# EAGLE schematic Module_AIO (EAGLE 9.2.1)

## Sheet 1 of 5: ANALOG INPUT
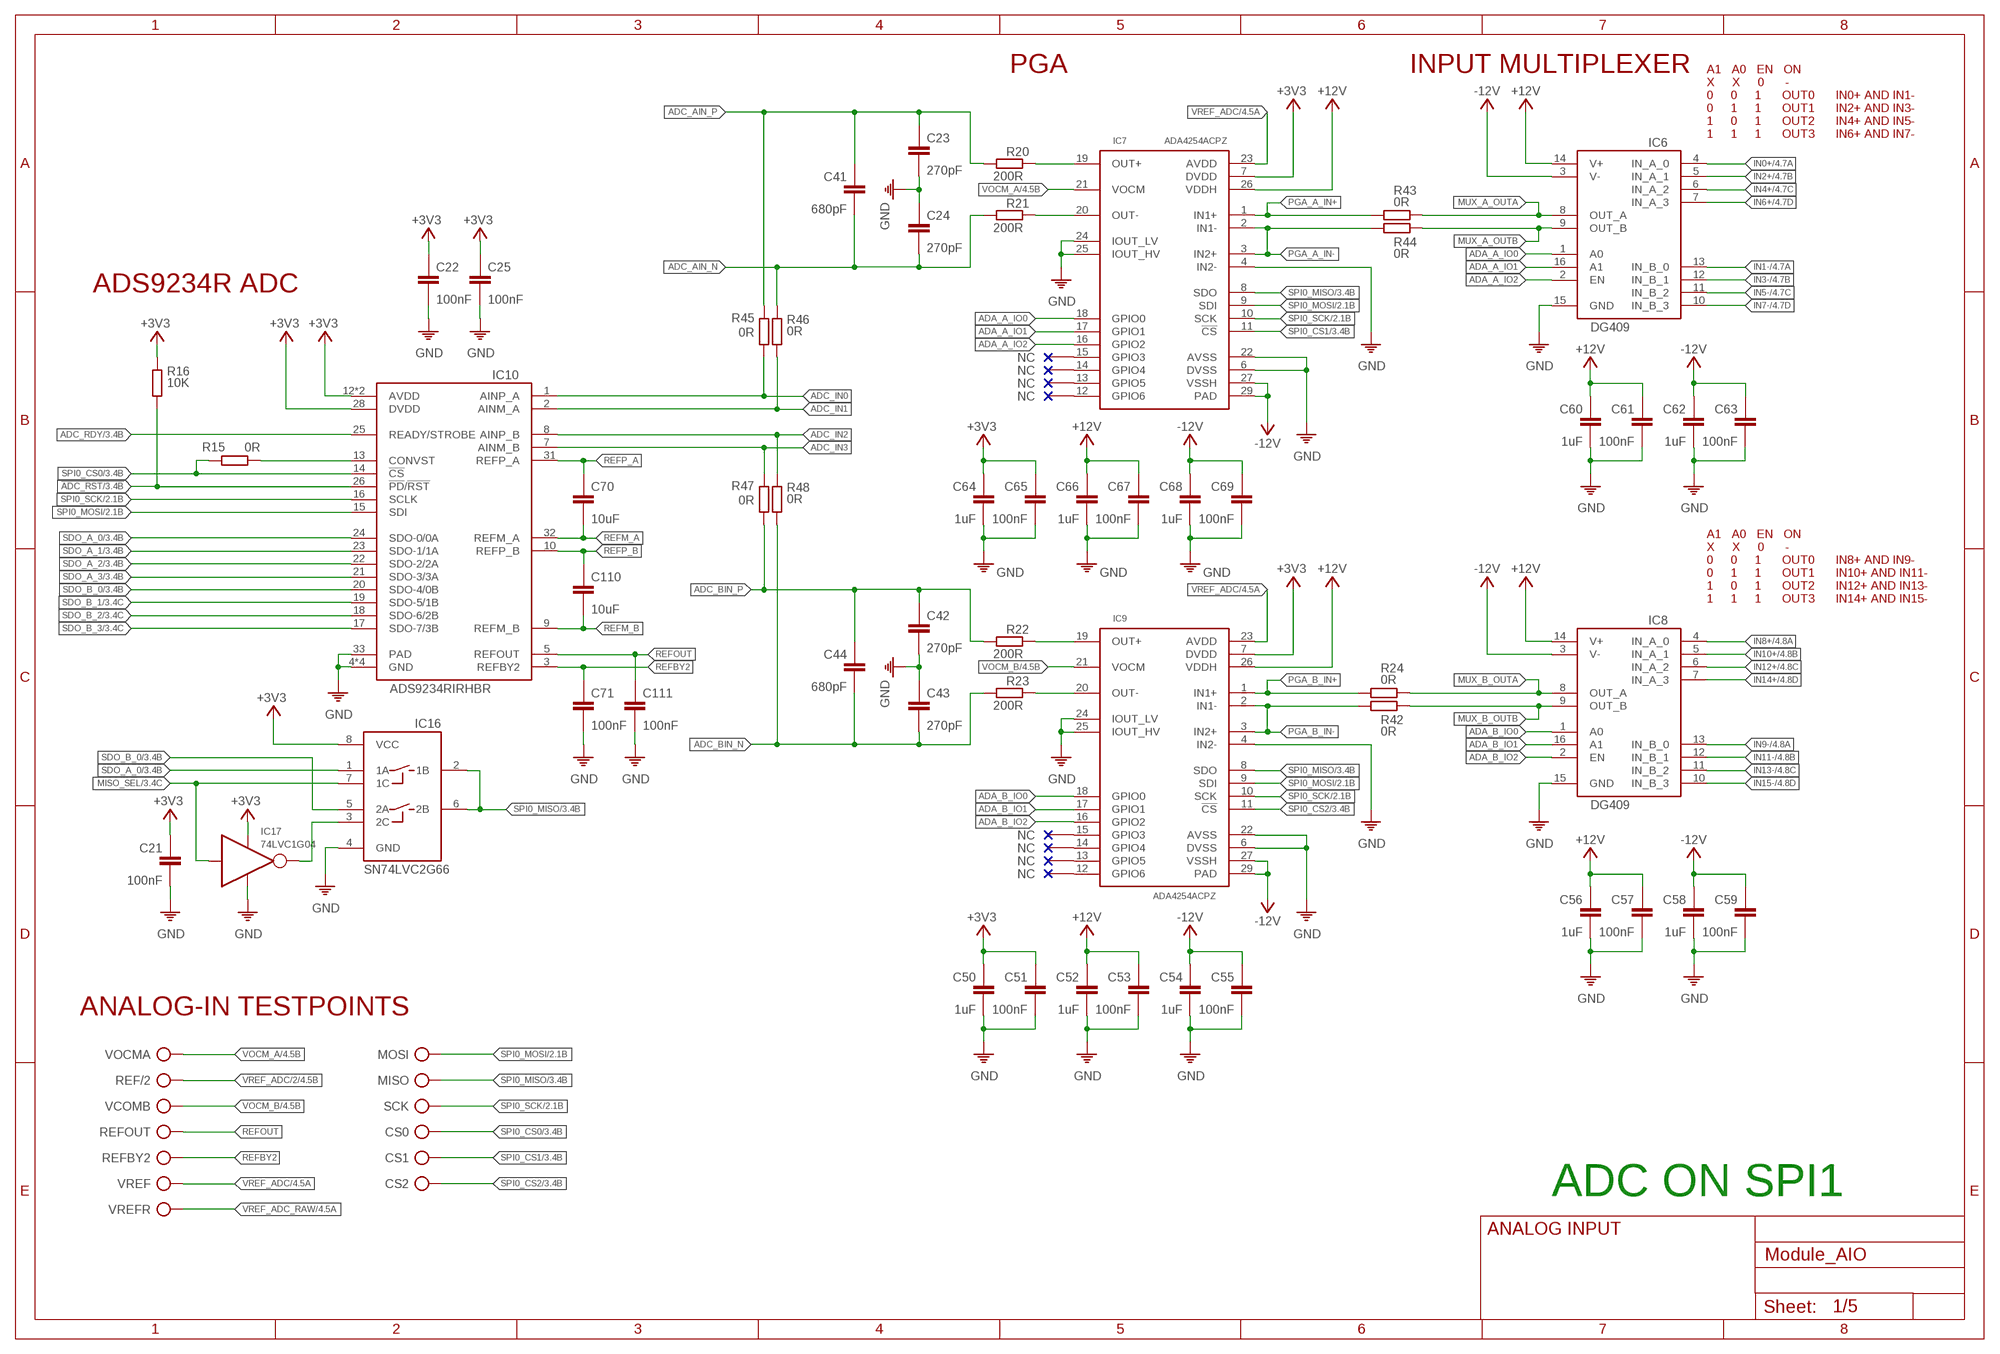
[diagram p0: schematic, sheet 1]

### Parts
C21  100nF  C-0402  [C0402]
C22  100nF  C-0402  [C0402]
C23  270pF  C-0402  [C0402]
C24  270pF  C-0402  [C0402]
C25  100nF  C-0402  [C0402]
C41  680pF  C-0402  [C0402]
C42  270pF  C-0402  [C0402]
C43  270pF  C-0402  [C0402]
C44  680pF  C-0402  [C0402]
C50  1uF  C-0402  [C0402]
C51  100nF  C-0402  [C0402]
C52  1uF  C-0402  [C0402]
C53  100nF  C-0402  [C0402]
C54  1uF  C-0402  [C0402]
C55  100nF  C-0402  [C0402]
C56  1uF  C-0402  [C0402]
C57  100nF  C-0402  [C0402]
C58  1uF  C-0402  [C0402]
C59  100nF  C-0402  [C0402]
C60  1uF  C-0402  [C0402]
C61  100nF  C-0402  [C0402]
C62  1uF  C-0402  [C0402]
C63  100nF  C-0402  [C0402]
C64  1uF  C-0402  [C0402]
C65  100nF  C-0402  [C0402]
C66  1uF  C-0402  [C0402]
C67  100nF  C-0402  [C0402]
C68  1uF  C-0402  [C0402]
C69  100nF  C-0402  [C0402]
C70  10uF  C-0402  [C0402]
C71  100nF  C-0402  [C0402]
C110  10uF  C-0402  [C0402]
C111  100nF  C-0402  [C0402]
CS0  TP  [TP]
CS1  TP  [TP]
CS2  TP  [TP]
IC6  DG409  DG409EUE+  [TSSOP2]
IC7  ADA4254ACPZ  [QFN50P500X500X75-29T314N]
IC8  DG409  DG409EUE+  [TSSOP2]
IC9  ADA4254ACPZ  [QFN50P500X500X75-29T314N]
IC10  ADS9234RIRHBR  [VQFN32-5X5]
IC16  SN74LVC2G66  [SOP50P310X90-8N]
IC17  74LVC1G04  [SOT95P280X145-5N]
MISO  TP  [TP]
MOSI  TP  [TP]
R15  0R  R0402  [0402]
R16  10K  R0402  [0402]
R20  200R  R0402  [0402]
R21  200R  R0402  [0402]
R22  200R  R0402  [0402]
R23  200R  R0402  [0402]
R24  0R  R0402  [0402]
R42  0R  R0402  [0402]
R43  0R  R0402  [0402]
R44  0R  R0402  [0402]
R45  0R  R0402  [0402]
R46  0R  R0402  [0402]
R47  0R  R0402  [0402]
R48  0R  R0402  [0402]
REF/2  TP  [TP]
REFBY2  TP  [TP]
REFOUT  TP  [TP]
SCK  TP  [TP]
VCOMB  TP  [TP]
VOCMA  TP  [TP]
VREF  TP  [TP]
VREFR  TP  [TP]

### Nets
!ADC_RST: IC10.26(!PD!/!RST) R16.2 ; also sheet 3,4
!MISO_SEL: IC16.3(2C) IC17.4(OUT)
+3V3: C21.1 C22.1 C25.1 C50.1 C51.1 C64.1 C65.1 IC7.7(DVDD) IC9.7(DVDD) IC10.12(AVDD) IC10.28(DVDD) IC10.29(AVDD) IC16.8(VCC) IC17.5(V+) R16.1 ; also sheet 2,3,4
+12V: C52.1 C53.1 C56.1 C57.1 C60.1 C61.1 C66.1 C67.1 IC6.14(V+) IC7.26(VDDH) IC8.14(V+) IC9.26(VDDH) ; also sheet 2,5
-12V: C54.1 C55.1 C58.1 C59.1 C62.1 C63.1 C68.1 C69.1 IC6.3(V-) IC7.27(VSSH) IC7.29(PAD) IC8.3(V-) IC9.27(VSSH) IC9.29(PAD) ; also sheet 2,5
ADA_A_IO0: IC6.1(A0) IC7.18(GPIO0)
ADA_A_IO1: IC6.16(A1) IC7.17(GPIO1)
ADA_A_IO2: IC6.2(EN) IC7.16(GPIO2)
ADA_B_IO0: IC8.1(A0) IC9.18(GPIO0)
ADA_B_IO1: IC8.16(A1) IC9.17(GPIO1)
ADA_B_IO2: IC8.2(EN) IC9.16(GPIO2)
ADC_AIN_N [100R_DIFFPAIR]: C24.2 C41.2 R21.1 R46.1
ADC_AIN_P [100R_DIFFPAIR]: C23.1 C41.1 R20.1 R45.2
ADC_BIN_N [100R_DIFFPAIR]: C43.2 C44.2 R23.1 R48.2
ADC_BIN_P [100R_DIFFPAIR]: C42.1 C44.1 R22.1 R47.1
ADC_IN0: IC10.1(AINP_A) R45.1
ADC_IN1: IC10.2(AINM_A) R46.2
ADC_IN2: IC10.8(AINP_B) R48.1
ADC_IN3: IC10.7(AINM_B) R47.2
ADC_RDY: IC10.25(READY/STROBE) ; also sheet 3,4
GND: C21.2 C22.2 C23.2 C24.1 C25.2 C42.2 C43.1 C50.2 C51.2 C52.2 C53.2 C54.2 C55.2 C56.2 C57.2 C58.2 C59.2 C60.2 C61.2 C62.2 C63.2 C64.2 C65.2 C66.2 C67.2 C68.2 C69.2 C71.2 C111.2 IC6.15(GND) IC7.4(IN2-) IC7.6(DVSS) IC7.22(AVSS) IC7.24(IOUT_LV) IC7.25(IOUT_HV) IC8.15(GND) IC9.4(IN2-) IC9.6(DVSS) IC9.22(AVSS) IC9.24(IOUT_LV) IC9.25(IOUT_HV) IC10.4(GND) IC10.11(GND) IC10.27(GND) IC10.30(GND) IC10.33(PAD) IC16.4(GND) IC17.3(V-) ; also sheet 2,3,4,5
IN0+: IC6.4(IN_A_0) ; also sheet 4
IN1-: IC6.13(IN_B_0) ; also sheet 4
IN2+: IC6.5(IN_A_1) ; also sheet 4
IN3-: IC6.12(IN_B_1) ; also sheet 4
IN4+: IC6.6(IN_A_2) ; also sheet 4
IN5-: IC6.11(IN_B_2) ; also sheet 4
IN6+: IC6.7(IN_A_3) ; also sheet 4
IN7-: IC6.10(IN_B_3) ; also sheet 4
IN8+: IC8.4(IN_A_0) ; also sheet 4
IN9-: IC8.13(IN_B_0) ; also sheet 4
IN10+: IC8.5(IN_A_1) ; also sheet 4
IN11-: IC8.12(IN_B_1) ; also sheet 4
IN12+: IC8.6(IN_A_2) ; also sheet 4
IN13-: IC8.11(IN_B_2) ; also sheet 4
IN14+: IC8.7(IN_A_3) ; also sheet 4
IN15-: IC8.10(IN_B_3) ; also sheet 4
MISO_SEL: IC16.7(1C) IC17.2(IN) ; also sheet 3,4
MUX_A_OUTA: IC6.8(OUT_A) R43.2
MUX_A_OUTB: IC6.9(OUT_B) R44.1
MUX_B_OUTA: IC8.8(OUT_A) R24.2
MUX_B_OUTB: IC8.9(OUT_B) R42.1
N$12: IC7.19(OUT+) R20.2
N$13: IC7.20(OUT-) R21.2
N$15: IC9.19(OUT+) R22.2
N$16: IC9.20(OUT-) R23.2
N$18: IC10.13(CONVST) R15.2
PGA_A_IN+: IC7.1(IN1+) R43.1
PGA_A_IN-: IC7.2(IN1-) IC7.3(IN2+) R44.2
PGA_B_IN+: IC9.1(IN1+) R24.1
PGA_B_IN-: IC9.2(IN1-) IC9.3(IN2+) R42.2
REFBY2: C71.1 IC10.3(REFBY2) REFBY2.TP
REFM_A: C70.2 IC10.32(REFM_A)
REFM_B: C110.2 IC10.9(REFM_B)
REFOUT: C111.1 IC10.5(REFOUT) REFOUT.TP
REFP_A: C70.1 IC10.31(REFP_A)
REFP_B: C110.1 IC10.10(REFP_B)
SDO_A_0: IC10.24(SDO-0/0A) IC16.1(1A) ; also sheet 3,4
SDO_A_1: IC10.23(SDO-1/1A) ; also sheet 3,4
SDO_A_2: IC10.22(SDO-2/2A) ; also sheet 3,4
SDO_A_3: IC10.21(SDO-3/3A) ; also sheet 3,4
SDO_B_0: IC10.20(SDO-4/0B) IC16.5(2A) ; also sheet 3,4
SDO_B_1: IC10.19(SDO-5/1B) ; also sheet 3,4
SDO_B_2: IC10.18(SDO-6/2B) ; also sheet 3,4
SDO_B_3: IC10.17(SDO-7/3B) ; also sheet 3,4
SPI0_CS0: CS0.TP IC10.14(!CS) R15.1 ; also sheet 3,4
SPI0_CS1: CS1.TP IC7.11(!CS) ; also sheet 3,4
SPI0_CS2: CS2.TP IC9.11(!CS) ; also sheet 3,4
SPI0_MISO: IC7.8(SDO) IC9.8(SDO) IC16.2(1B) IC16.6(2B) MISO.TP ; also sheet 3,4
SPI0_MOSI: IC7.9(SDI) IC9.9(SDI) IC10.15(SDI) MOSI.TP ; also sheet 2,3,4
SPI0_SCK: IC7.10(SCK) IC9.10(SCK) IC10.16(SCLK) SCK.TP ; also sheet 2,3,4
VOCM_A: IC7.21(VOCM) VOCMA.TP ; also sheet 4
VOCM_B: IC9.21(VOCM) VCOMB.TP ; also sheet 4
VREF_ADC: IC7.23(AVDD) IC9.23(AVDD) VREF.TP ; also sheet 4
VREF_ADC/2: REF/2.TP ; also sheet 4
VREF_ADC_RAW: VREFR.TP ; also sheet 4
Unconnected: IC7.12(GPIO6) IC7.13(GPIO5) IC7.14(GPIO4) IC7.15(GPIO3) IC9.12(GPIO6) IC9.13(GPIO5) IC9.14(GPIO4) IC9.15(GPIO3)

### Notes on the sheet
- PGA | INPUT MULTIPLEXER | A1   A0   EN   ON
- X     X     0      -
- 0     0     1      OUT0 | IN0+ AND IN1-
- 0     1     1      OUT1 | IN2+ AND IN3-
- 1     0     1      OUT2 | IN4+ AND IN5-
- 1     1     1      OUT3 | IN6+ AND IN7-
- ADS9234R ADC
- A1   A0   EN   ON
- X     X     0      -
- 0     0     1      OUT0 | IN8+ AND IN9-
- 0     1     1      OUT1 | IN10+ AND IN11-
- 1     0     1      OUT2 | IN12+ AND IN13-
- 1     1     1      OUT3 | IN14+ AND IN15-
- ANALOG-IN TESTPOINTS
- ADC ON SPI1
- ANALOG INPUT

## Sheet 2 of 5: ANALOG OUTPUT
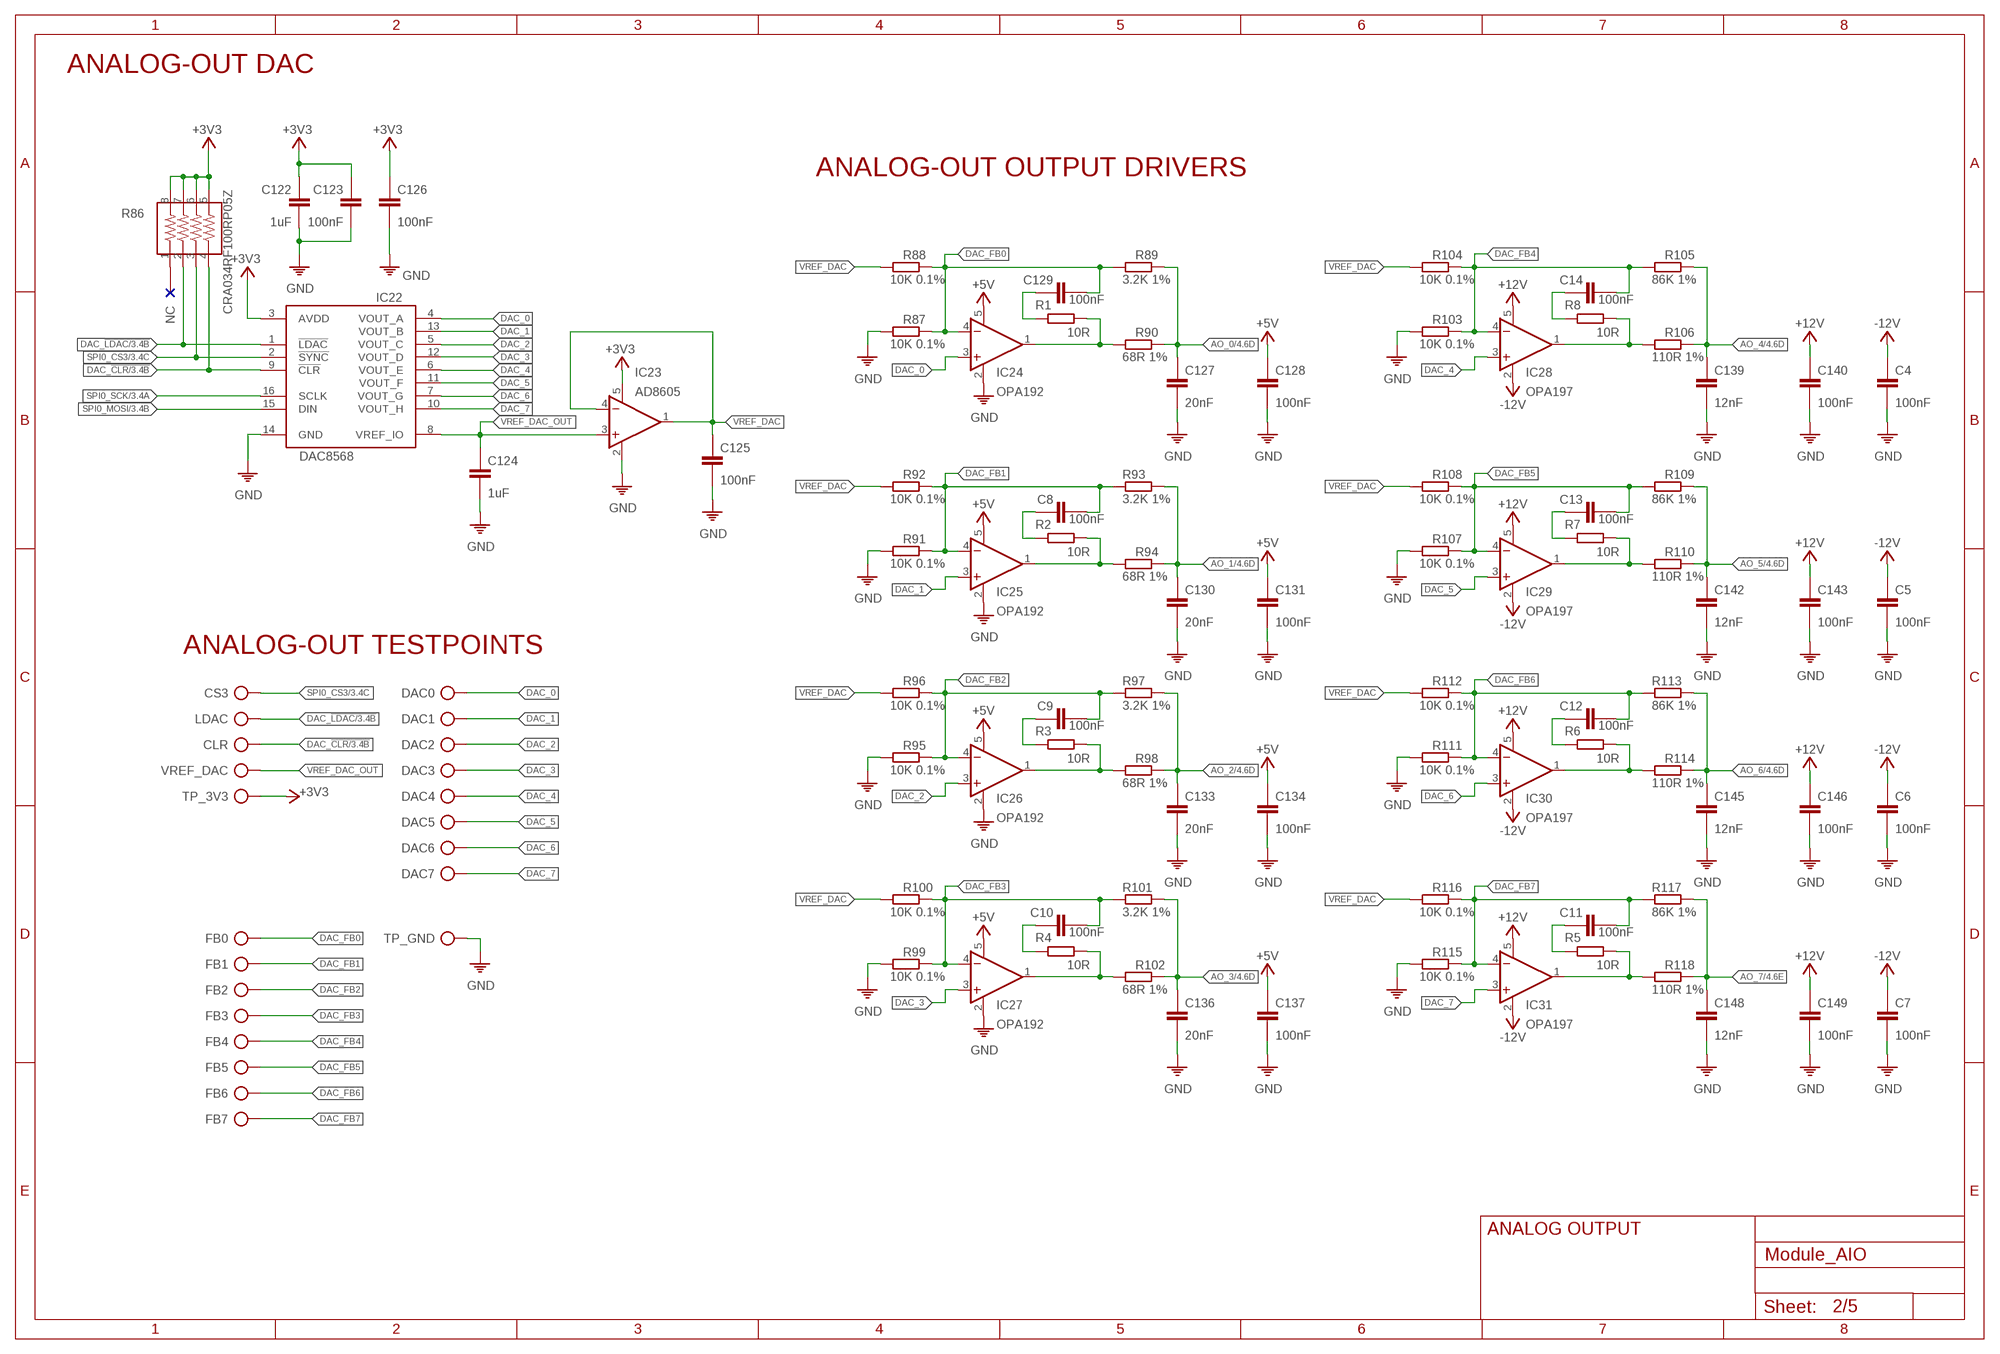
[diagram p1: schematic, sheet 2]

### Parts
C4  100nF  C-0402  [C0402]
C5  100nF  C-0402  [C0402]
C6  100nF  C-0402  [C0402]
C7  100nF  C-0402  [C0402]
C8  100nF  C-0402  [C0402]
C9  100nF  C-0402  [C0402]
C10  100nF  C-0402  [C0402]
C11  100nF  C-0402  [C0402]
C12  100nF  C-0402  [C0402]
C13  100nF  C-0402  [C0402]
C14  100nF  C-0402  [C0402]
C122  1uF  C-0402  [C0402]
C123  100nF  C-0402  [C0402]
C124  1uF  C-0402  [C0402]
C125  100nF  C-0402  [C0402]
C126  100nF  C-0402  [C0402]
C127  20nF  C-0402  [C0402]
C128  100nF  C-0402  [C0402]
C129  100nF  C-0402  [C0402]
C130  20nF  C-0402  [C0402]
C131  100nF  C-0402  [C0402]
C133  20nF  C-0402  [C0402]
C134  100nF  C-0402  [C0402]
C136  20nF  C-0402  [C0402]
C137  100nF  C-0402  [C0402]
C139  12nF  C-0402  [C0402]
C140  100nF  C-0402  [C0402]
C142  12nF  C-0402  [C0402]
C143  100nF  C-0402  [C0402]
C145  12nF  C-0402  [C0402]
C146  100nF  C-0402  [C0402]
C148  12nF  C-0402  [C0402]
C149  100nF  C-0402  [C0402]
CLR  TP  [TP]
CS3  TP  [TP]
DAC0  TP  [TP]
DAC1  TP  [TP]
DAC2  TP  [TP]
DAC3  TP  [TP]
DAC4  TP  [TP]
DAC5  TP  [TP]
DAC6  TP  [TP]
DAC7  TP  [TP]
FB0  TP  [TP]
FB1  TP  [TP]
FB2  TP  [TP]
FB3  TP  [TP]
FB4  TP  [TP]
FB5  TP  [TP]
FB6  TP  [TP]
FB7  TP  [TP]
IC22  DAC8568  [TSSOP16]
IC23  AD8605  [SOT23-5]
IC24  OPA192  [SOT23-5]
IC25  OPA192  [SOT23-5]
IC26  OPA192  [SOT23-5]
IC27  OPA192  [SOT23-5]
IC28  OPA197  [SOT23-5]
IC29  OPA197  [SOT23-5]
IC30  OPA197  [SOT23-5]
IC31  OPA197  [SOT23-5]
LDAC  TP  [TP]
R1  10R  R0402  [0402]
R2  10R  R0402  [0402]
R3  10R  R0402  [0402]
R4  10R  R0402  [0402]
R5  10R  R0402  [0402]
R6  10R  R0402  [0402]
R7  10R  R0402  [0402]
R8  10R  R0402  [0402]
R86  CRA034RF100RP05Z  YC164-JR-0733RL  [YC164-JR-0733RL]
R87  10K 0.1%  R0402  [0402]
R88  10K 0.1%  R0402  [0402]
R89  3.2K 1%  R0402  [0402]
R90  68R 1%  R0402  [0402]
R91  10K 0.1%  R0402  [0402]
R92  10K 0.1%  R0402  [0402]
R93  3.2K 1%  R0402  [0402]
R94  68R 1%  R0402  [0402]
R95  10K 0.1%  R0402  [0402]
R96  10K 0.1%  R0402  [0402]
R97  3.2K 1%  R0402  [0402]
R98  68R 1%  R0402  [0402]
R99  10K 0.1%  R0402  [0402]
R100  10K 0.1%  R0402  [0402]
R101  3.2K 1%  R0402  [0402]
R102  68R 1%  R0402  [0402]
R103  10K 0.1%  R0402  [0402]
R104  10K 0.1%  R0402  [0402]
R105  86K 1%  R0402  [0402]
R106  110R 1%  R0402  [0402]
R107  10K 0.1%  R0402  [0402]
R108  10K 0.1%  R0402  [0402]
R109  86K 1%  R0402  [0402]
R110  110R 1%  R0402  [0402]
R111  10K 0.1%  R0402  [0402]
R112  10K 0.1%  R0402  [0402]
R113  86K 1%  R0402  [0402]
R114  110R 1%  R0402  [0402]
R115  10K 0.1%  R0402  [0402]
R116  10K 0.1%  R0402  [0402]
R117  86K 1%  R0402  [0402]
R118  110R 1%  R0402  [0402]
TP_3V3  TP  [TP]
TP_GND  TP  [TP]
VREF_DAC  TP  [TP]

### Nets
+3V3: C122.1 C123.1 C126.1 IC22.3(AVDD) IC23.5(V+) R86.5 R86.6 R86.7 R86.8 TP_3V3.TP ; also sheet 1,3,4
+5V: C128.1 C131.1 C134.1 C137.1 IC24.5(V+) IC25.5(V+) IC26.5(V+) IC27.5(V+) ; also sheet 3,4,5
+12V: C140.1 C143.1 C146.1 C149.1 IC28.5(V+) IC29.5(V+) IC30.5(V+) IC31.5(V+) ; also sheet 1,5
-12V: C4.1 C5.1 C6.1 C7.1 IC28.2(V-) IC29.2(V-) IC30.2(V-) IC31.2(V-) ; also sheet 1,5
AO_0: C127.1 R89.2 R90.2 ; also sheet 4
AO_1: C130.1 R93.2 R94.2 ; also sheet 4
AO_2: C133.1 R97.2 R98.2 ; also sheet 4
AO_3: C136.1 R101.2 R102.2 ; also sheet 4
AO_4: C139.1 R105.2 R106.2 ; also sheet 4
AO_5: C142.1 R109.2 R110.2 ; also sheet 4
AO_6: C145.1 R113.2 R114.2 ; also sheet 4
AO_7: C148.1 R117.2 R118.2 ; also sheet 4
DAC_0: DAC0.TP IC22.4(VOUT_A) IC24.3(+IN)
DAC_1: DAC1.TP IC22.13(VOUT_B) IC25.3(+IN)
DAC_2: DAC2.TP IC22.5(VOUT_C) IC26.3(+IN)
DAC_3: DAC3.TP IC22.12(VOUT_D) IC27.3(+IN)
DAC_4: DAC4.TP IC22.6(VOUT_E) IC28.3(+IN)
DAC_5: DAC5.TP IC22.11(VOUT_F) IC29.3(+IN)
DAC_6: DAC6.TP IC22.7(VOUT_G) IC30.3(+IN)
DAC_7: DAC7.TP IC22.10(VOUT_H) IC31.3(+IN)
DAC_!CLR: CLR.TP IC22.9(!CLR) R86.4 ; also sheet 3,4
DAC_!LDAC: IC22.1(!LDAC) LDAC.TP R86.2 ; also sheet 3,4
DAC_FB0: C129.2 FB0.TP IC24.4(-IN) R87.2 R88.2 R89.1
DAC_FB1: C8.2 FB1.TP IC25.4(-IN) R91.2 R92.2 R93.1
DAC_FB2: C9.2 FB2.TP IC26.4(-IN) R95.2 R96.2 R97.1
DAC_FB3: C10.2 FB3.TP IC27.4(-IN) R99.2 R100.2 R101.1
DAC_FB4: C14.2 FB4.TP IC28.4(-IN) R103.2 R104.2 R105.1
DAC_FB5: C13.2 FB5.TP IC29.4(-IN) R107.2 R108.2 R109.1
DAC_FB6: C12.2 FB6.TP IC30.4(-IN) R111.2 R112.2 R113.1
DAC_FB7: C11.2 FB7.TP IC31.4(-IN) R115.2 R116.2 R117.1
GND: C4.2 C5.2 C6.2 C7.2 C122.2 C123.2 C124.2 C125.2 C126.2 C127.2 C128.2 C130.2 C131.2 C133.2 C134.2 C136.2 C137.2 C139.2 C140.2 C142.2 C143.2 C145.2 C146.2 C148.2 C149.2 IC22.14(GND) IC23.2(V-) IC24.2(V-) IC25.2(V-) IC26.2(V-) IC27.2(V-) R87.1 R91.1 R95.1 R99.1 R103.1 R107.1 R111.1 R115.1 TP_GND.TP ; also sheet 1,3,4,5
N$3: C129.1 R1.2
N$5: C8.1 R2.2
N$7: C9.1 R3.2
N$9: C10.1 R4.2
N$14: IC24.1(OUT) R1.1 R90.1
N$17: C11.1 R5.2
N$23: IC25.1(OUT) R2.1 R94.1
N$25: C12.1 R6.2
N$26: IC26.1(OUT) R3.1 R98.1
N$28: IC27.1(OUT) R4.1 R102.1
N$31: C13.1 R7.2
N$33: IC28.1(OUT) R8.1 R106.1
N$40: IC29.1(OUT) R7.1 R110.1
N$41: C14.1 R8.2
N$58: IC30.1(OUT) R6.1 R114.1
N$60: IC31.1(OUT) R5.1 R118.1
SPI0_CS3: CS3.TP IC22.2(!SYNC) R86.3 ; also sheet 3,4
SPI0_MOSI: IC22.15(DIN) ; also sheet 1,3,4
SPI0_SCK: IC22.16(SCLK) ; also sheet 1,3,4
VREF_DAC: C125.1 IC23.1(OUT) IC23.4(-IN) R88.1 R92.1 R96.1 R100.1 R104.1 R108.1 R112.1 R116.1
VREF_DAC_OUT: C124.1 IC22.8(VREF_IO) IC23.3(+IN) VREF_DAC.TP
Unconnected: R86.1

### Notes on the sheet
- ANALOG-OUT DAC
- ANALOG-OUT OUTPUT DRIVERS
- ANALOG-OUT TESTPOINTS
- ANALOG OUTPUT

## Sheet 3 of 5
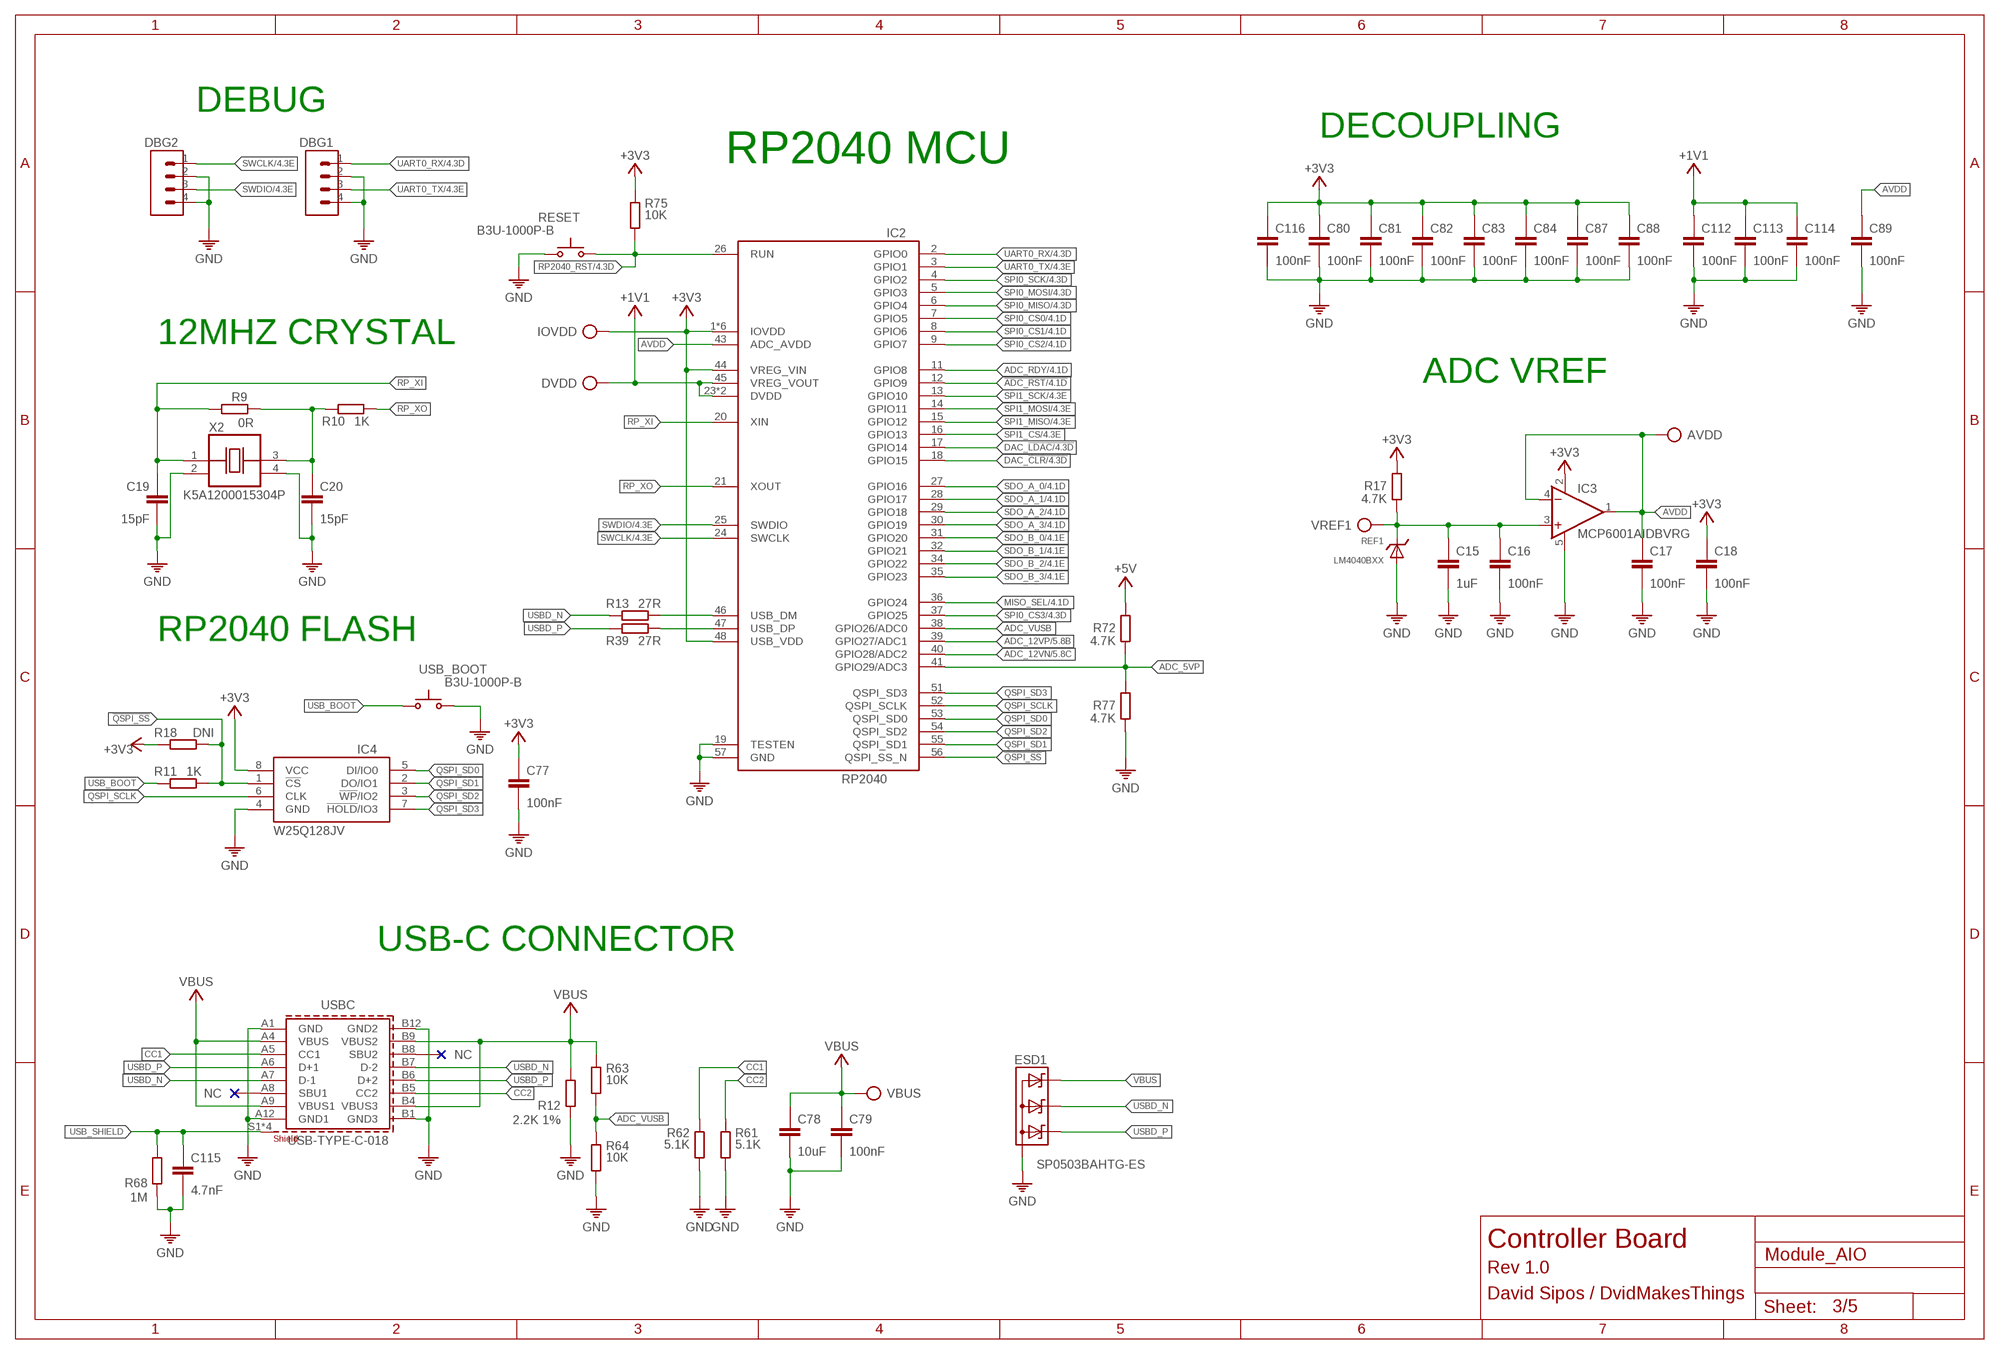
[diagram p2: schematic, sheet 3]

### Parts
AVDD  TP  [TP]
C15  1uF  C-0402  [C0402]
C16  100nF  C-0402  [C0402]
C17  100nF  C-0402  [C0402]
C18  100nF  C-0402  [C0402]
C19  15pF  C-0402  [C0402]
C20  15pF  C-0402  [C0402]
C77  100nF  C-0402  [C0402]
C78  10uF  C0805  [0805]
C79  100nF  C0402  [0402]
C80  100nF  C-0402  [C0402]
C81  100nF  C-0402  [C0402]
C82  100nF  C-0402  [C0402]
C83  100nF  C-0402  [C0402]
C84  100nF  C-0402  [C0402]
C87  100nF  C-0402  [C0402]
C88  100nF  C-0402  [C0402]
C89  100nF  C-0402  [C0402]
C112  100nF  C-0402  [C0402]
C113  100nF  C-0402  [C0402]
C114  100nF  C-0402  [C0402]
C115  4.7nF  C0402  [0402]
C116  100nF  C-0402  [C0402]
DBG1  CON-1X4  [1X4]
DBG2  CON-1X4  [1X4]
DVDD  TP  [TP]
ESD1  SP0503BAHTG-ES  SP0503BAHT  [SOT143]
IC2  RP2040  [QFN40P700X700X100-57T510]
IC3  MCP6001AIDBVRG  MCP6001RT  [SOT23-5]
IC4  W25Q128JVPIQ  W25Q128JVP  [SON127P600X500X75-8N]
IOVDD  TP  [TP]
R9  0R  R0402  [0402]
R10  1K  R0402  [0402]
R11  1K  R0402  [0402]
R12  2.2K 1%  R0402  [0402]
R13  27R  R0402  [0402]
R17  4.7K  R0402  [0402]
R18  DNI  R0402  [0402]
R39  27R  R0402  [0402]
R61  5.1K  R0402  [0402]
R62  5.1K  R0402  [0402]
R63  10K  R0402  [0402]
R64  10K  R0402  [0402]
R68  1M  R0402  [0402]
R72  4.7K  R0402  [0402]
R75  10K  R0402  [0402]
R77  4.7K  R0402  [0402]
REF1  LM4040BXX  [SOT23]
RESET  B3U-1000P-B  SWITCH-OMRON_B3U-1000P  [SWITCH-OMRON_B3U-1000P]
USB_BOOT  B3U-1000P-B  SWITCH-OMRON_B3U-1000P  [SWITCH-OMRON_B3U-1000P]
USBC  USB-TYPE-C-018  629722000214  [629722000214]
VBUS  TP  [TP]
VREF1  TP  [TP]
X2  K5A1200015304P  CRYSTAL  [OSCCC500X320X130]

### Nets
!ADC_RST: IC2.12(GPIO9) ; also sheet 1,4
!QSPI_SS: IC2.56(QSPI_SS_N) IC4.1(!CS) R11.2 R18.1
+1V1: C112.1 C113.1 C114.1 DVDD.TP IC2.23(DVDD) IC2.45(VREG_VOUT) IC2.50(DVDD)
+3V3: C18.1 C77.1 C80.1 C81.1 C82.1 C83.1 C84.1 C87.1 C88.1 C116.1 IC2.1(IOVDD) IC2.10(IOVDD) IC2.22(IOVDD) IC2.33(IOVDD) IC2.42(IOVDD) IC2.44(VREG_VIN) IC2.48(USB_VDD) IC2.49(IOVDD) IC3.2(V+) IC4.8(VCC) IOVDD.TP R17.2 R18.2 R75.1 ; also sheet 1,2,4
+5V: R72.2 ; also sheet 2,4,5
ADC_5VP: IC2.41(GPIO29/ADC3) R72.1 R77.2
ADC_12VN: IC2.40(GPIO28/ADC2) ; also sheet 5
ADC_12VP: IC2.39(GPIO27/ADC1) ; also sheet 5
ADC_RDY: IC2.11(GPIO8) ; also sheet 1,4
ADC_VUSB: IC2.38(GPIO26/ADC0) R63.2 R64.1
AVDD: AVDD.TP C17.1 C89.1 IC2.43(ADC_AVDD) IC3.1(OUT) IC3.4(-IN)
CC1: R62.1 USBC.A5(CC1)
CC2: R61.1 USBC.B5(CC2)
DAC_!CLR: IC2.18(GPIO15) ; also sheet 2,4
DAC_!LDAC: IC2.17(GPIO14) ; also sheet 2,4
GND: C15.2 C16.2 C17.2 C18.2 C19.2 C20.2 C77.2 C78.2 C79.2 C80.2 C81.2 C82.2 C83.2 C84.2 C87.2 C88.2 C89.2 C112.2 C113.2 C114.2 C115.2 C116.2 DBG1.2 DBG1.4 DBG2.2 DBG2.4 ESD1.1(A) IC2.19(TESTEN) IC2.57(GND) IC3.5(V-) IC4.4(GND) R12.2 R61.2 R62.2 R64.2 R68.2 R77.1 REF1.2(A) REF1.3(A) RESET.2(S) USB_BOOT.2(S) USBC.A1(GND) USBC.A12(GND1) USBC.B1(GND3) USBC.B12(GND2) X2.2(VSS) X2.4(VDD) ; also sheet 1,2,4,5
MISO_SEL: IC2.36(GPIO24) ; also sheet 1,4
N$1: C20.1 R9.2 R10.1 X2.3(OUT)
QSPI_SCLK: IC2.52(QSPI_SCLK) IC4.6(CLK)
QSPI_SD0: IC2.53(QSPI_SD0) IC4.5(DI/IO0)
QSPI_SD1: IC2.55(QSPI_SD1) IC4.2(DO/IO1)
QSPI_SD2: IC2.54(QSPI_SD2) IC4.3(!WP!/IO2)
QSPI_SD3: IC2.51(QSPI_SD3) IC4.7(!HOLD!/IO3)
RP2040_RST: IC2.26(RUN) R75.2 RESET.1(P) ; also sheet 4
RP_USBD_N [90R_DIFFPAIR]: IC2.46(USB_DM) R13.2
RP_USBD_P [90R_DIFFPAIR]: IC2.47(USB_DP) R39.2
RP_XI: C19.1 IC2.20(XIN) R9.1 X2.1(CON)
RP_XO: IC2.21(XOUT) R10.2
SDO_A_0: IC2.27(GPIO16) ; also sheet 1,4
SDO_A_1: IC2.28(GPIO17) ; also sheet 1,4
SDO_A_2: IC2.29(GPIO18) ; also sheet 1,4
SDO_A_3: IC2.30(GPIO19) ; also sheet 1,4
SDO_B_0: IC2.31(GPIO20) ; also sheet 1,4
SDO_B_1: IC2.32(GPIO21) ; also sheet 1,4
SDO_B_2: IC2.34(GPIO22) ; also sheet 1,4
SDO_B_3: IC2.35(GPIO23) ; also sheet 1,4
SPI0_CS0: IC2.7(GPIO5) ; also sheet 1,4
SPI0_CS1: IC2.8(GPIO6) ; also sheet 1,4
SPI0_CS2: IC2.9(GPIO7) ; also sheet 1,4
SPI0_CS3: IC2.37(GPIO25) ; also sheet 2,4
SPI0_MISO: IC2.6(GPIO4) ; also sheet 1,4
SPI0_MOSI: IC2.5(GPIO3) ; also sheet 1,2,4
SPI0_SCK: IC2.4(GPIO2) ; also sheet 1,2,4
SPI1_CS: IC2.16(GPIO13) ; also sheet 4
SPI1_MISO: IC2.15(GPIO12) ; also sheet 4
SPI1_MOSI: IC2.14(GPIO11) ; also sheet 4
SPI1_SCK: IC2.13(GPIO10) ; also sheet 4
SWCLK: DBG2.1 IC2.24(SWCLK) ; also sheet 4
SWDIO: DBG2.3 IC2.25(SWDIO) ; also sheet 4
UART0_RX: DBG1.1 IC2.2(GPIO0) ; also sheet 4
UART0_TX: DBG1.3 IC2.3(GPIO1) ; also sheet 4
USB_BOOT: R11.1 USB_BOOT.1(P)
USB_SHIELD: C115.1 R68.1 USBC.S1(SHIELD) USBC.S2(SHIELD) USBC.S3(SHIELD) USBC.S4(SHIELD)
USBD_N [90R_DIFFPAIR]: ESD1.3(C2) R13.1 USBC.A7(D-1) USBC.B7(D-2)
USBD_P [90R_DIFFPAIR]: ESD1.2(C1) R39.1 USBC.A6(D+1) USBC.B6(D+2)
VBUS: C78.1 C79.1 ESD1.4(C3) R12.1 R63.1 USBC.A4(VBUS) USBC.A9(VBUS1) USBC.B4(VBUS3) USBC.B9(VBUS2) VBUS.TP ; also sheet 4
VREF: C15.1 C16.1 IC3.3(+IN) R17.1 REF1.1(C) VREF1.TP
Unconnected: USBC.A8(SBU1) USBC.B8(SBU2)

### Notes on the sheet
- DEBUG
- DECOUPLING
- RP2040 MCU
- 12MHZ CRYSTAL
- ADC VREF
- RP2040 FLASH
- USB-C CONNECTOR
- Controller Board
- Rev 1.0
- David Sipos / DvidMakesThings

## Sheet 4 of 5: SYSTEM POWER AND CONNECTORS
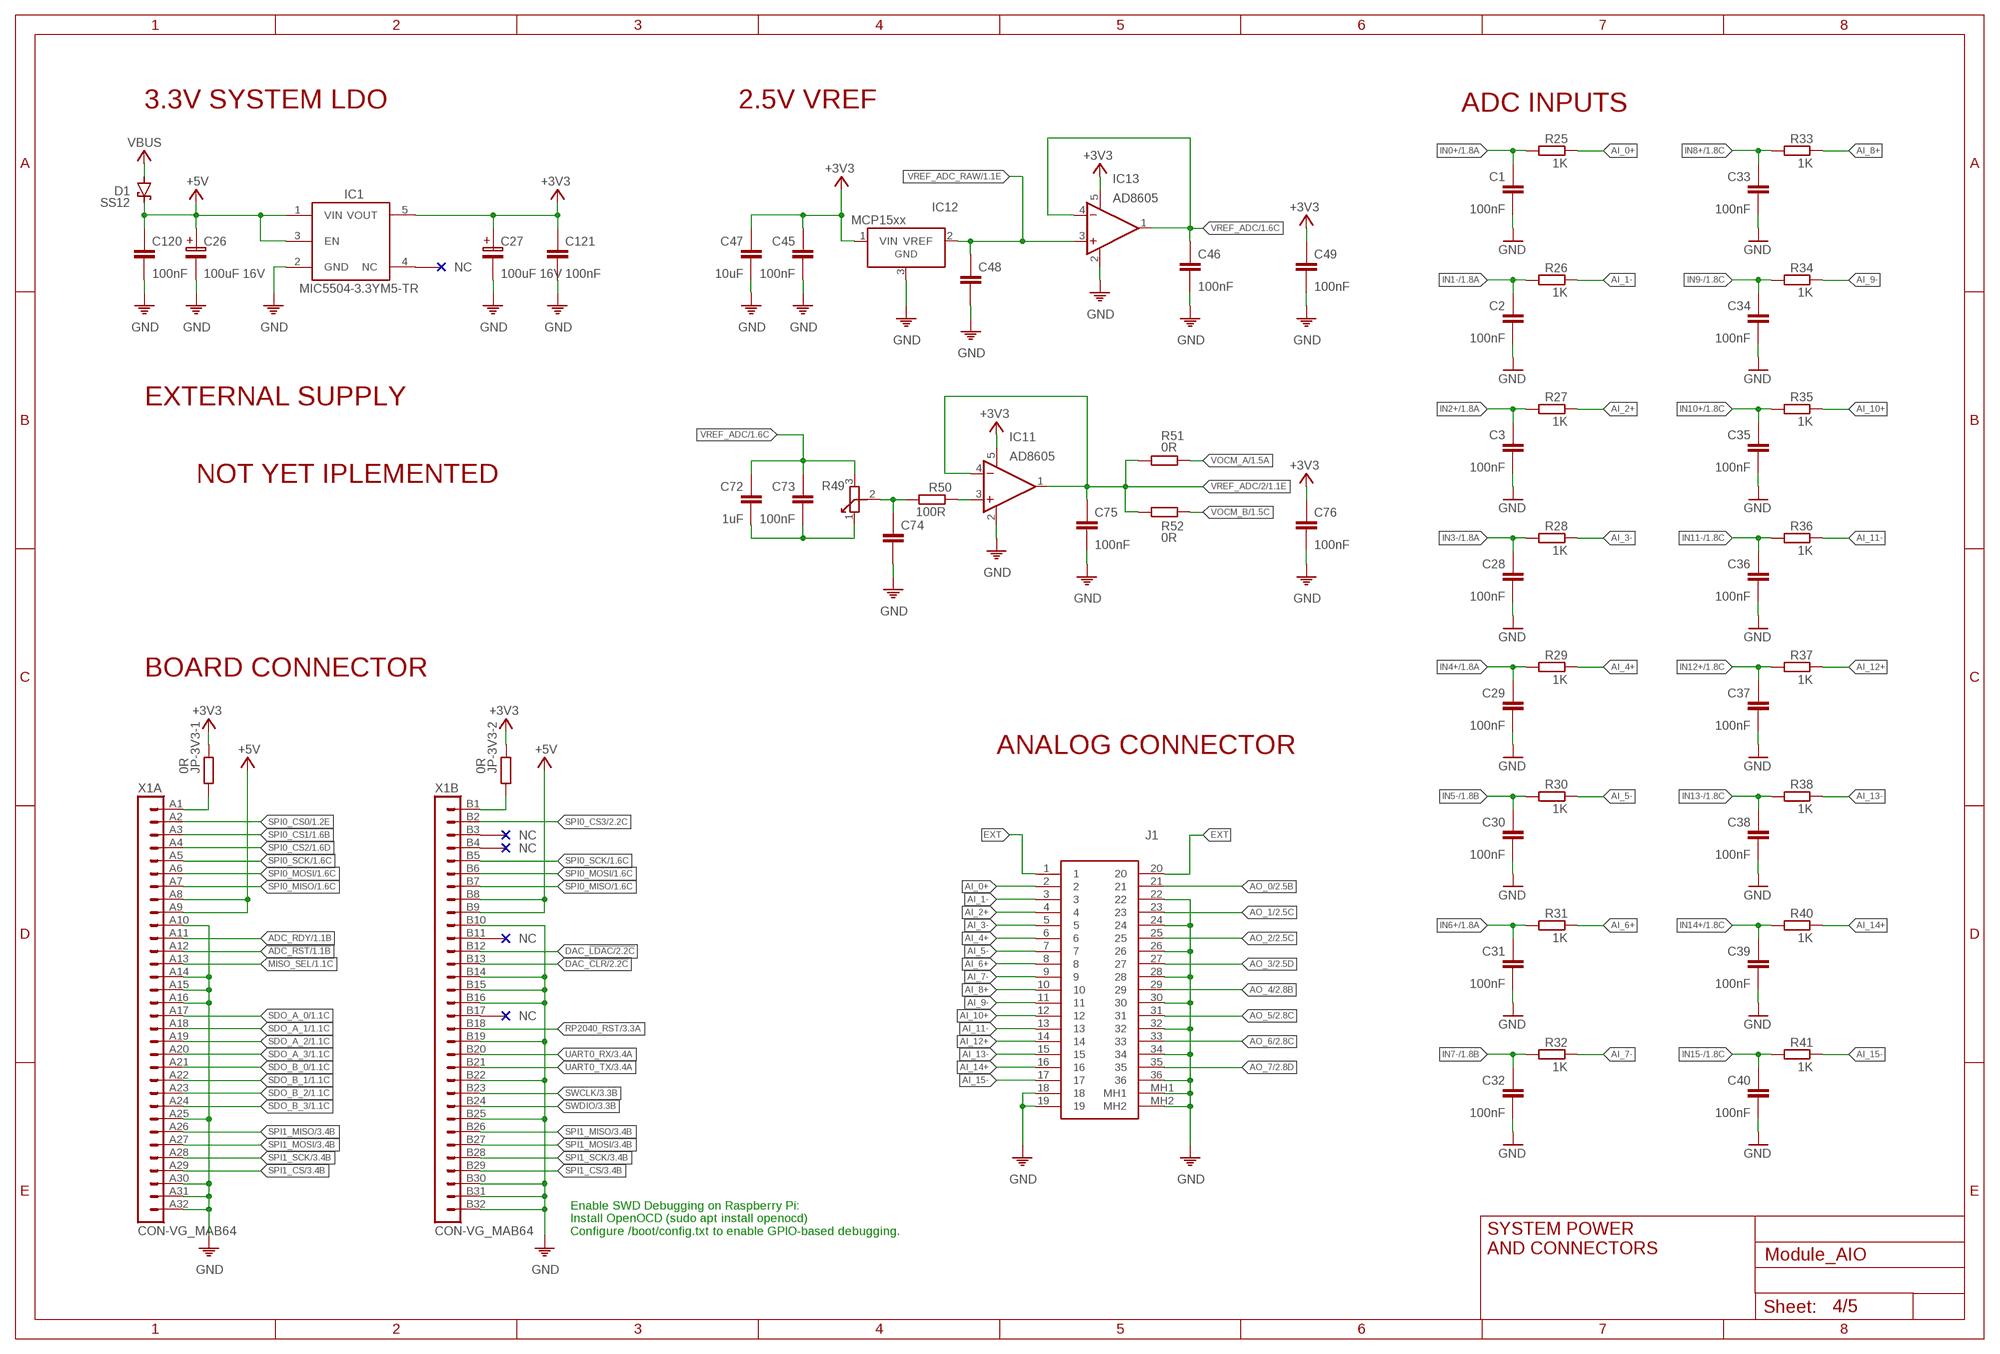
[diagram p3: schematic, sheet 4]

### Parts
C1  100nF  C-0402  [C0402]
C2  100nF  C-0402  [C0402]
C3  100nF  C-0402  [C0402]
C26  100uF 16V  CPOL  [100UF-16V]
C27  100uF 16V  CPOL  [100UF-16V]
C28  100nF  C-0402  [C0402]
C29  100nF  C-0402  [C0402]
C30  100nF  C-0402  [C0402]
C31  100nF  C-0402  [C0402]
C32  100nF  C-0402  [C0402]
C33  100nF  C-0402  [C0402]
C34  100nF  C-0402  [C0402]
C35  100nF  C-0402  [C0402]
C36  100nF  C-0402  [C0402]
C37  100nF  C-0402  [C0402]
C38  100nF  C-0402  [C0402]
C39  100nF  C-0402  [C0402]
C40  100nF  C-0402  [C0402]
C45  100nF  C-0402  [C0402]
C46  100nF  C-0402  [C0402]
C47  10uF  C-0402  [C0402]
C48  C-0402  [C0402]
C49  100nF  C-0402  [C0402]
C72  1uF  C-0402  [C0402]
C73  100nF  C-0402  [C0402]
C74  C-0402  [C0402]
C75  100nF  C-0402  [C0402]
C76  100nF  C-0402  [C0402]
C120  100nF  C-0402  [C0402]
C121  100nF  C-0402  [C0402]
D1  SS12  [SMA]
IC1  MIC5504-3.3YM5-TR  [SOT23-5]
IC11  AD8605  [SOT23-5]
IC12  MCP1525T-I/TT  [SOT23]
IC13  AD8605  [SOT23-5]
J1  N10236-52B3PC  [MDB36]
JP-3V3-1  0R  R0603  [0603]
JP-3V3-2  0R  R0603  [0603]
R25  1K  R0402  [0402]
R26  1K  R0402  [0402]
R27  1K  R0402  [0402]
R28  1K  R0402  [0402]
R29  1K  R0402  [0402]
R30  1K  R0402  [0402]
R31  1K  R0402  [0402]
R32  1K  R0402  [0402]
R33  1K  R0402  [0402]
R34  1K  R0402  [0402]
R35  1K  R0402  [0402]
R36  1K  R0402  [0402]
R37  1K  R0402  [0402]
R38  1K  R0402  [0402]
R40  1K  R0402  [0402]
R41  1K  R0402  [0402]
R49  R-TRIM  [TC33X]
R50  100R  R0402  [0402]
R51  0R  R0603  [0603]
R52  0R  R0603  [0603]
X1  CON-VG_MAB64  [CON-VG_MAB64]

### Nets
!ADC_RST: X1.A12 ; also sheet 1,3
+3V3: C27.1 C45.1 C47.1 C49.1 C76.1 C121.1 IC1.5(VOUT) IC11.5(V+) IC12.1(VIN) IC13.5(V+) JP-3V3-1.1 JP-3V3-2.1 ; also sheet 1,2,3
+5V: C26.1 C120.1 D1.C IC1.1(VIN) IC1.3(EN) X1.A8 X1.A9 X1.B8 X1.B9 ; also sheet 2,3,5
ADC_RDY: X1.A11 ; also sheet 1,3
AI_0+: J1.2 R25.1
AI_1-: J1.3 R26.1
AI_2+: J1.4 R27.1
AI_3-: J1.5 R28.1
AI_4+: J1.6 R29.1
AI_5-: J1.7 R30.1
AI_6+: J1.8 R31.1
AI_7-: J1.9 R32.1
AI_8+: J1.10 R33.1
AI_9-: J1.11 R34.1
AI_10+: J1.12 R35.1
AI_11-: J1.13 R36.1
AI_12+: J1.14 R37.1
AI_13-: J1.15 R38.1
AI_14+: J1.16 R40.1
AI_15-: J1.17 R41.1
AO_0: J1.21 ; also sheet 2
AO_1: J1.23 ; also sheet 2
AO_2: J1.25 ; also sheet 2
AO_3: J1.27 ; also sheet 2
AO_4: J1.29 ; also sheet 2
AO_5: J1.31 ; also sheet 2
AO_6: J1.33 ; also sheet 2
AO_7: J1.35 ; also sheet 2
DAC_!CLR: X1.B13 ; also sheet 2,3
DAC_!LDAC: X1.B12 ; also sheet 2,3
EXT: J1.1 J1.20
GND: C1.2 C2.2 C3.2 C26.2 C27.2 C28.2 C29.2 C30.2 C31.2 C32.2 C33.2 C34.2 C35.2 C36.2 C37.2 C38.2 C39.2 C40.2 C45.2 C46.2 C47.2 C48.2 C49.2 C74.2 C75.2 C76.2 C120.2 C121.2 IC1.2(GND) IC11.2(V-) IC12.3(GND) IC13.2(V-) J1.18 J1.19 J1.22 J1.24 J1.26 J1.28 J1.30 J1.32 J1.34 J1.36 J1.MH1 J1.MH2 X1.A10 X1.A14 X1.A15 X1.A16 X1.A25 X1.A30 X1.A31 X1.A32 X1.B10 X1.B14 X1.B15 X1.B16 X1.B19 X1.B22 X1.B25 X1.B30 X1.B31 X1.B32 ; also sheet 1,2,3,5
IN0+: C1.1 R25.2 ; also sheet 1
IN1-: C2.1 R26.2 ; also sheet 1
IN2+: C3.1 R27.2 ; also sheet 1
IN3-: C28.1 R28.2 ; also sheet 1
IN4+: C29.1 R29.2 ; also sheet 1
IN5-: C30.1 R30.2 ; also sheet 1
IN6+: C31.1 R31.2 ; also sheet 1
IN7-: C32.1 R32.2 ; also sheet 1
IN8+: C33.1 R33.2 ; also sheet 1
IN9-: C34.1 R34.2 ; also sheet 1
IN10+: C35.1 R35.2 ; also sheet 1
IN11-: C36.1 R36.2 ; also sheet 1
IN12+: C37.1 R37.2 ; also sheet 1
IN13-: C38.1 R38.2 ; also sheet 1
IN14+: C39.1 R40.2 ; also sheet 1
IN15-: C40.1 R41.2 ; also sheet 1
MISO_SEL: X1.A13 ; also sheet 1,3
N$4: JP-3V3-1.2 X1.A1
N$6: JP-3V3-2.2 X1.B1
N$19: C72.2 C73.2 R49.1
N$20: C74.1 R49.2 R50.1
N$21: IC11.3(+IN) R50.2
RP2040_RST: X1.B18 ; also sheet 3
SDO_A_0: X1.A17 ; also sheet 1,3
SDO_A_1: X1.A18 ; also sheet 1,3
SDO_A_2: X1.A19 ; also sheet 1,3
SDO_A_3: X1.A20 ; also sheet 1,3
SDO_B_0: X1.A21 ; also sheet 1,3
SDO_B_1: X1.A22 ; also sheet 1,3
SDO_B_2: X1.A23 ; also sheet 1,3
SDO_B_3: X1.A24 ; also sheet 1,3
SPI0_CS0: X1.A2 ; also sheet 1,3
SPI0_CS1: X1.A3 ; also sheet 1,3
SPI0_CS2: X1.A4 ; also sheet 1,3
SPI0_CS3: X1.B2 ; also sheet 2,3
SPI0_MISO: X1.A7 X1.B7 ; also sheet 1,3
SPI0_MOSI: X1.A6 X1.B6 ; also sheet 1,2,3
SPI0_SCK: X1.A5 X1.B5 ; also sheet 1,2,3
SPI1_CS: X1.A29 X1.B29 ; also sheet 3
SPI1_MISO: X1.A26 X1.B26 ; also sheet 3
SPI1_MOSI: X1.A27 X1.B27 ; also sheet 3
SPI1_SCK: X1.A28 X1.B28 ; also sheet 3
SWCLK: X1.B23 ; also sheet 3
SWDIO: X1.B24 ; also sheet 3
UART0_RX: X1.B20 ; also sheet 3
UART0_TX: X1.B21 ; also sheet 3
VBUS: D1.A ; also sheet 3
VOCM_A: R51.2 ; also sheet 1
VOCM_B: R52.1 ; also sheet 1
VREF_ADC: C46.1 C72.1 C73.1 IC13.1(OUT) IC13.4(-IN) R49.3 ; also sheet 1
VREF_ADC/2: C75.1 IC11.1(OUT) IC11.4(-IN) R51.1 R52.2 ; also sheet 1
VREF_ADC_RAW: C48.1 IC12.2(VREF) IC13.3(+IN) ; also sheet 1
Unconnected: IC1.4(NC) X1.B3 X1.B4 X1.B11 X1.B17

### Notes on the sheet
- 3.3V SYSTEM LDO | 2.5V VREF
- ADC INPUTS
- EXTERNAL SUPPLY
- NOT YET IPLEMENTED
- BOARD CONNECTOR
- ANALOG CONNECTOR
- SYSTEM POWER 
  AND CONNECTORS
- Enable SWD Debugging on Raspberry Pi:
  Install OpenOCD (sudo apt install openocd)
  Configure /boot/config.txt to enable GPIO-based debugging.

## Sheet 5 of 5: AI-POWER
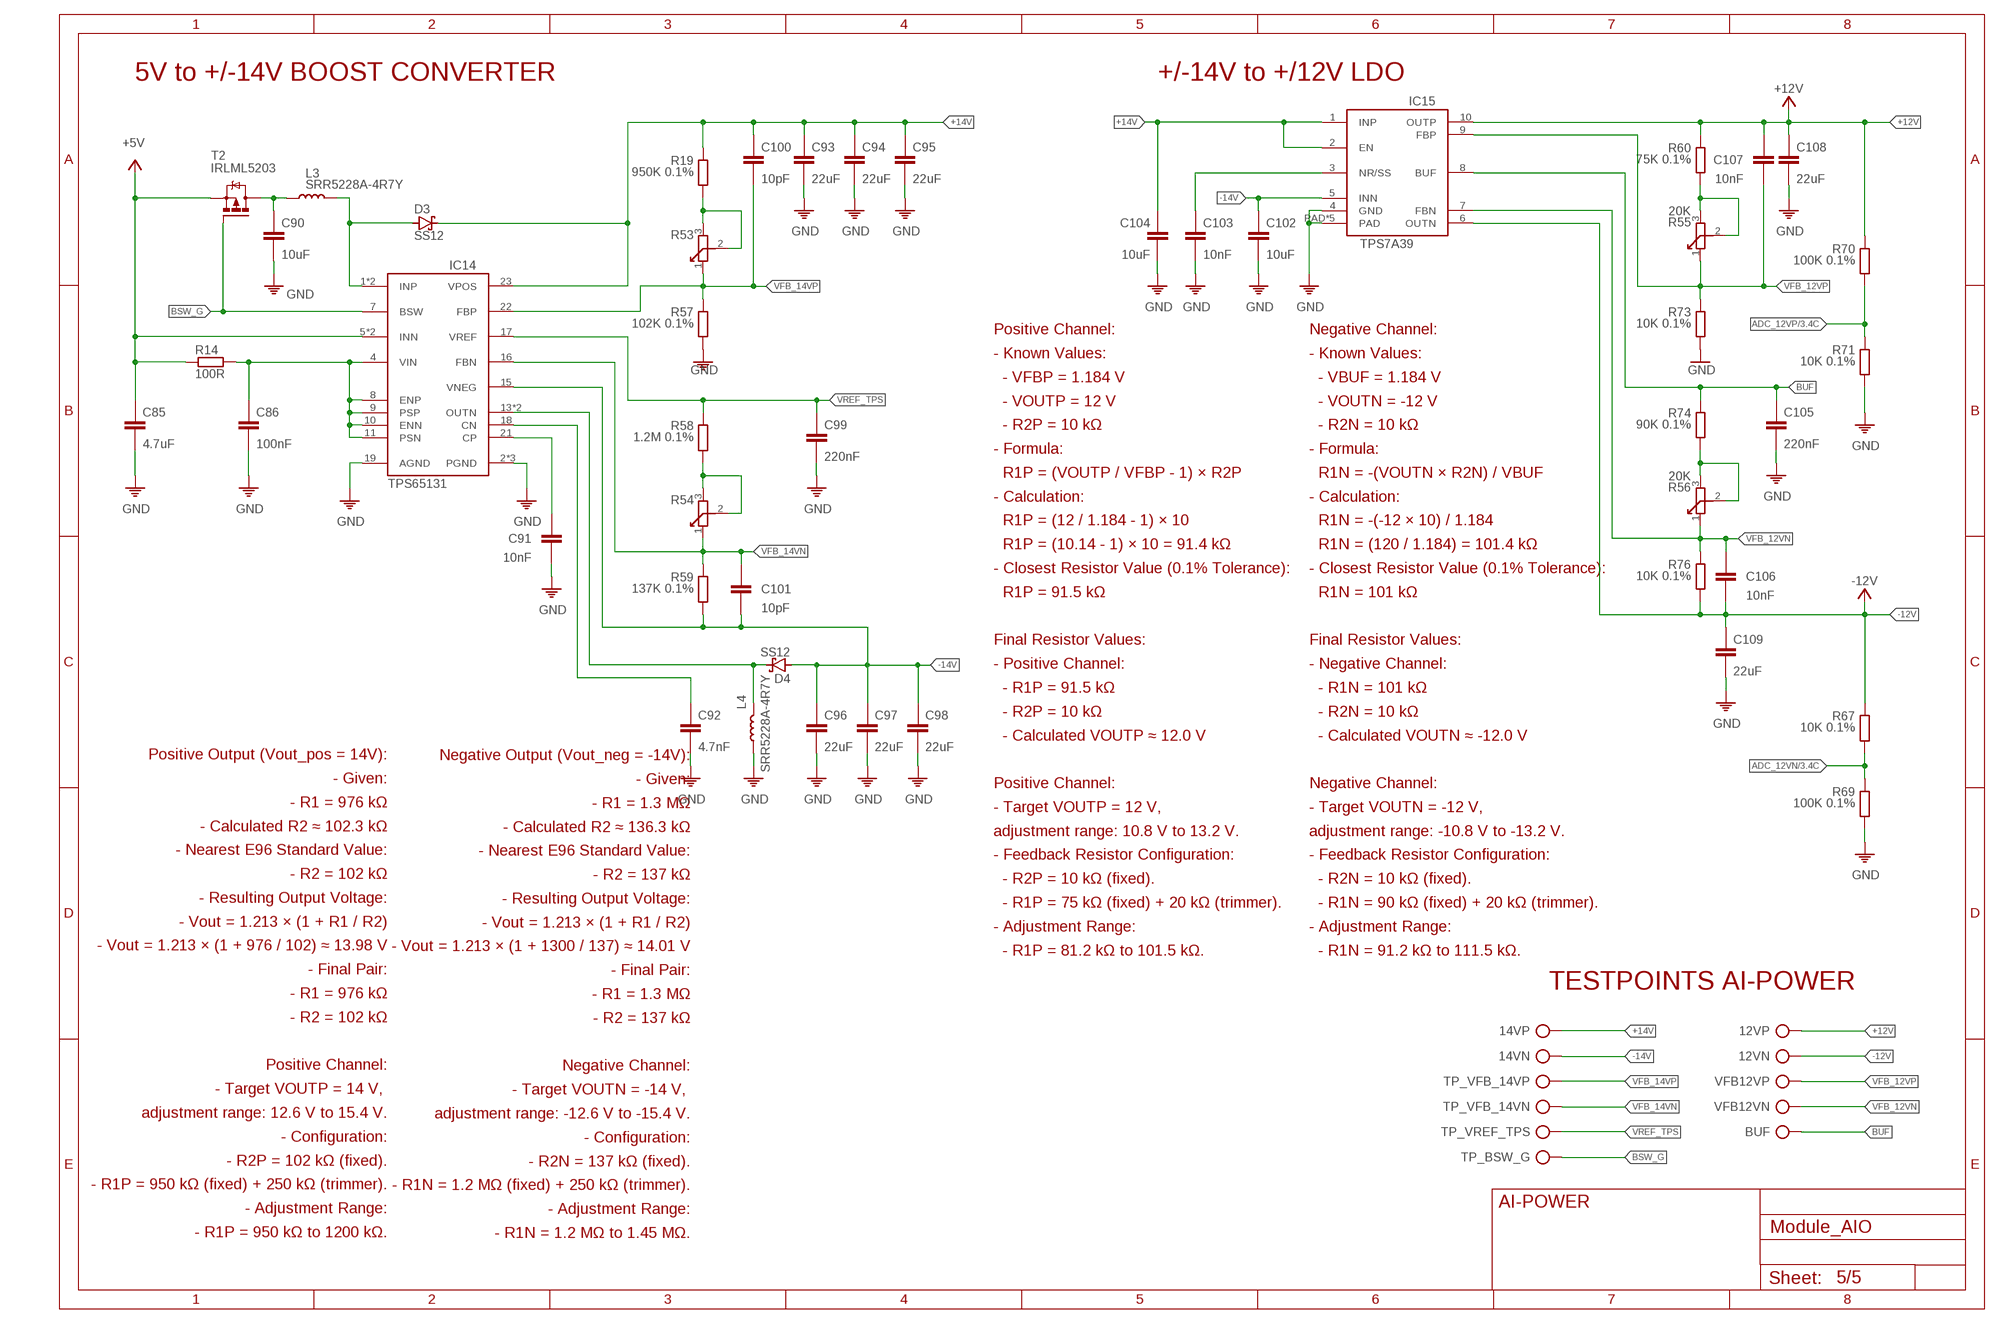
[diagram p4: schematic, sheet 5]

### Parts
12VN  TP  [TP]
12VP  TP  [TP]
14VN  TP  [TP]
14VP  TP  [TP]
BUF  TP  [TP]
C85  4.7uF  C-0402  [C0402]
C86  100nF  C-0402  [C0402]
C90  10uF  C-0402  [C0402]
C91  10nF  C-0402  [C0402]
C92  4.7nF  C-0402  [C0402]
C93  22uF  C-0805  [C0805]
C94  22uF  C-0805  [C0805]
C95  22uF  C-0805  [C0805]
C96  22uF  C-0805  [C0805]
C97  22uF  C-0805  [C0805]
C98  22uF  C-0805  [C0805]
C99  220nF  C-0402  [C0402]
C100  10pF  C-0402  [C0402]
C101  10pF  C-0402  [C0402]
C102  10uF  C-0805  [C0805]
C103  10nF  C-0402  [C0402]
C104  10uF  C-0805  [C0805]
C105  220nF  C-0402  [C0402]
C106  10nF  C-0402  [C0402]
C107  10nF  C-0402  [C0402]
C108  22uF  C-0805  [C0805]
C109  22uF  C-0805  [C0805]
D3  SS12  [SMA]
D4  SS12  [SMA]
IC14  TPS65131  TPS65131TRGERQ1  [VQFN24-4X4-THERMAL2.5X2.5]
IC15  TPS7A39  TPS7A3901DSCR  [WSON10-3X3]
L3  SRR5228A-4R7Y  L  [SRR5228A]
L4  SRR5228A-4R7Y  L  [SRR5228A]
R14  100R  R1206  [1206]
R19  950K 0.1%  R0402  [0402]
R53  R-TRIM  [TC33X]
R54  R-TRIM  [TC33X]
R55  20K  R-TRIM  [TC33X]
R56  20K  R-TRIM  [TC33X]
R57  102K 0.1%  R0402  [0402]
R58  1.2M 0.1%  R0402  [0402]
R59  137K 0.1%  R0402  [0402]
R60  75K 0.1%  R0402  [0402]
R67  10K 0.1%  R0402  [0402]
R69  100K 0.1%  R0402  [0402]
R70  100K 0.1%  R0402  [0402]
R71  10K 0.1%  R0402  [0402]
R73  10K 0.1%  R0402  [0402]
R74  90K 0.1%  R0402  [0402]
R76  10K 0.1%  R0402  [0402]
T2  IRLML5203  [MICRO3]
TP_BSW_G  TP  [TP]
TP_VFB_14VN  TP  [TP]
TP_VFB_14VP  TP  [TP]
TP_VREF_TPS  TP  [TP]
VFB12VN  TP  [TP]
VFB12VP  TP  [TP]

### Nets
+5V: C85.1 IC14.5(INN) IC14.6(INN) R14.2 T2.2(S) ; also sheet 2,3,4
+12V: 12VP.TP C107.2 C108.1 IC15.10(OUTP) R60.1 R70.1 ; also sheet 1,2
+14V: 14VP.TP C93.1 C94.1 C95.1 C100.1 C104.1 D3.C IC14.23(VPOS) IC15.1(INP) IC15.2(EN) R19.1
-12V: 12VN.TP C106.1 C109.1 IC15.6(OUTN) R67.1 R76.2 ; also sheet 1,2
-14V: 14VN.TP C96.1 C97.1 C98.1 C101.1 C102.1 D4.A IC14.15(VNEG) IC15.5(INN) R59.2
ADC_12VN: R67.2 R69.1 ; also sheet 3
ADC_12VP: R70.2 R71.1 ; also sheet 3
BSW_G: IC14.7(BSW) T2.1(G) TP_BSW_G.TP
BUF: BUF.TP C105.2 IC15.8(BUF) R74.1
GND: C85.2 C86.2 C90.2 C91.2 C92.2 C93.2 C94.2 C95.2 C96.2 C97.2 C98.2 C99.1 C102.2 C103.2 C104.2 C105.1 C108.2 C109.2 IC14.2(PGND) IC14.3(PGND) IC14.19(AGND) IC14.25(PGND) IC15.4(GND) IC15.PAD IC15.PAD1(PAD) IC15.PAD2(PAD) IC15.PAD3(PAD) IC15.PAD4(PAD) L4.1 R57.2 R69.2 R71.2 R73.2 ; also sheet 1,2,3,4
N$24: D3.A IC14.1(INP) IC14.24(INP) L3.2
N$30: C90.1 L3.1 T2.3(D)
N$32: C86.1 IC14.4(VIN) IC14.8(ENP) IC14.9(PSP) IC14.10(ENN) IC14.11(PSN) R14.1
N$35: C91.1 IC14.21(CP)
N$36: C92.1 IC14.18(CN)
N$37: D4.C IC14.13(OUTN) IC14.14(OUTN) L4.2
N$38: R55.2 R55.3 R60.2
N$39: C103.1 IC15.3(NR/SS)
N$42: R56.2 R56.3 R74.2
N$43: R19.2 R53.2 R53.3
N$44: R54.2 R54.3 R58.2
VFB_12VN: C106.2 IC15.7(FBN) R56.1 R76.1 VFB12VN.TP
VFB_12VP: C107.1 IC15.9(FBP) R55.1 R73.1 VFB12VP.TP
VFB_14VN: C101.2 IC14.16(FBN) R54.1 R59.1 TP_VFB_14VN.TP
VFB_14VP: C100.2 IC14.22(FBP) R53.1 R57.1 TP_VFB_14VP.TP
VREF_TPS: C99.2 IC14.17(VREF) R58.1 TP_VREF_TPS.TP

### Notes on the sheet
- 5V to +/-14V BOOST CONVERTER | +/-14V to +/12V LDO
- Positive Channel:
  - Known Values:
    - VFBP = 1.184 V
    - VOUTP = 12 V
    - R2P = 10 kΩ
  - Formula:
    R1P = (VOUTP / VFBP - 1) × R2P
  - Calculation:
    R1P = (12 / 1.184 - 1) × 10
    R1P = (10.14 - 1) × 10 = 91.4 kΩ
  - Closest Resistor Value (0.1% Tolerance):
    R1P = 91.5 kΩ
  
  Final Resistor Values:
  - Positive Channel:
    - R1P = 91.5 kΩ
    - R2P = 10 kΩ
    - Calculated VOUTP ≈ 12.0 V
  
  Positive Channel:
  - Target VOUTP = 12 V, 
  adjustment range: 10.8 V to 13.2 V.
  - Feedback Resistor Configuration:
    - R2P = 10 kΩ (fixed).
    - R1P = 75 kΩ (fixed) + 20 kΩ (trimmer).
  - Adjustment Range:
    - R1P = 81.2 kΩ to 101.5 kΩ.
- Negative Channel:
  - Known Values:
    - VBUF = 1.184 V
    - VOUTN = -12 V
    - R2N = 10 kΩ
  - Formula:
    R1N = -(VOUTN × R2N) / VBUF
  - Calculation:
    R1N = -(-12 × 10) / 1.184
    R1N = (120 / 1.184) = 101.4 kΩ
  - Closest Resistor Value (0.1% Tolerance):
    R1N = 101 kΩ
  
  Final Resistor Values:
  - Negative Channel:
    - R1N = 101 kΩ
    - R2N = 10 kΩ
    - Calculated VOUTN ≈ -12.0 V
  
  Negative Channel:
  - Target VOUTN = -12 V, 
  adjustment range: -10.8 V to -13.2 V.
  - Feedback Resistor Configuration:
    - R2N = 10 kΩ (fixed).
    - R1N = 90 kΩ (fixed) + 20 kΩ (trimmer).
  - Adjustment Range:
    - R1N = 91.2 kΩ to 111.5 kΩ.
- TESTPOINTS AI-POWER
- Positive Output (Vout_pos = 14V):
  - Given:
    - R1 = 976 kΩ
    - Calculated R2 ≈ 102.3 kΩ
  - Nearest E96 Standard Value:
    - R2 = 102 kΩ
  - Resulting Output Voltage:
    - Vout = 1.213 × (1 + R1 / R2)
    - Vout = 1.213 × (1 + 976 / 102) ≈ 13.98 V
  - Final Pair:
    - R1 = 976 kΩ
    - R2 = 102 kΩ
  
  Positive Channel:
  - Target VOUTP = 14 V, 
  adjustment range: 12.6 V to 15.4 V.
  - Configuration:
    - R2P = 102 kΩ (fixed).
    - R1P = 950 kΩ (fixed) + 250 kΩ (trimmer).
  - Adjustment Range:
    - R1P = 950 kΩ to 1200 kΩ.
- Negative Output (Vout_neg = -14V):
  - Given:
    - R1 = 1.3 MΩ
    - Calculated R2 ≈ 136.3 kΩ
  - Nearest E96 Standard Value:
    - R2 = 137 kΩ
  - Resulting Output Voltage:
    - Vout = 1.213 × (1 + R1 / R2)
    - Vout = 1.213 × (1 + 1300 / 137) ≈ 14.01 V
  - Final Pair:
    - R1 = 1.3 MΩ
    - R2 = 137 kΩ
  
  Negative Channel:
  - Target VOUTN = -14 V, 
  adjustment range: -12.6 V to -15.4 V.
  - Configuration:
    - R2N = 137 kΩ (fixed).
    - R1N = 1.2 MΩ (fixed) + 250 kΩ (trimmer).
  - Adjustment Range:
    - R1N = 1.2 MΩ to 1.45 MΩ.
- AI-POWER

## Library data of the parts
12VN 12VP 14VN 14VP AVDD BUF CLR CS0 CS1-CS3 DAC0 DAC1-DAC7 DVDD FB0 FB1-FB7 IOVDD LDAC MISO MOSI REF/2 REFBY2 REFOUT SCK TP_3V3 TP_BSW_G TP_GND TP_VFB_14VN TP_VFB_14VP TP_VREF_TPS VBUS VCOMB VFB12VN VFB12VP VOCMA VREF VREF1 VREF_DAC VREFR = ds_passive:TP
C1-C25 C28-C116 C120-C131 C133 C134 C136 C137 C139 C140 C142 C143 C145 C146 C148 C149 = ds_passive:C
C26 C27 = ds_passive:CPOL
D1 D3 D4 = Diodes:SS12: DIODE SCHOTTKY 20V 1A SMA Manufacturer's datasheet <https://www.onsemi.com/pub/Collateral/SS19-D.PDF>; CREATED_BY: PCBLayout.com; DIGIKEY_PART_NUMBER: SS12FSCT-ND; MANUFACTURER: ON Semiconductor; MPN: SS12; PACKAGE: SMA (DO-214AC)
DBG1 DBG2 = ds_con:CON-1X4
ESD1 = ds_ic_peripherals:SP0503BAHT: TVS Diode Arrays Surface Mount TVS Avalanche Diode Array
IC1 = ds_ic_vreg:MIC5504-3.3YM5-TR: The MIC5501/2/3/4 is an advanced general-purpose LDO ideal for powering general-purpose portable devices. The MIC5501/2/3/4 family of products provides a high-performance 300mA LDO
IC2 = ds_ic_mcu:RP2040
IC3 = ds_ic_opa:MCP6001RT: 1 MHz, Low-Power Op Amp
IC4 = MCU:W25Q128JV: 3V 128M-BIT SERIAL FLASH MEMORY WITH DUAL/QUAD SPI & QPI & DTR
IC6 IC8 = ds_ic_peripherals:DG409: DG409 is a dual 4 channel differential analog multiplexer designed to connect one of four differential inputs to a common dual output as determined by its 2-bit binary address (A0, A1)
IC7 IC9 = ds_ic_opa:ADA4254: Zero Drift, High Voltage, Low Power, Programmable Gain Instrumentation Amplifier
IC10 = ds_ic_peripherals:ADS9234R: ADS92x4R Dual, Low-Latency, Simultaneous-Sampling SAR ADC
IC11 IC13 IC23 = ds_ic_opa:AD8605: Precision, Low Noise, CMOS, Rail-to-Rail, Input/Output Operational Amplifiers
IC12 = ds_ic_vreg:MCP1525: 2.5V Voltage Reference
IC14 = ds_ic_vreg:TPS65131: Positive- and Negative-Output DC-DC Converter
IC15 = ds_ic_vreg:TPS7A39: Dual, 150-mA, Wide VIN Positive and Negative LDO Voltage Regulator
IC16 = ds_ic_peripherals:SN74LVC2G66: Dual Bilateral Analog Switch
IC17 = ds_ic_logic:74LVC1G04: Single inverter
IC22 = ds_ic_peripherals:DAC8568: Octal-Channel, Ultralow Glitch, Voltage Output, Digital-to-Analog Converters with 2.5-V 2-ppm/°C Internal Reference
IC24-IC27 = ds_ic_opa:OPA192: OPAx192 36-V, Precision, Rail-to-Rail Input/Output, Low Offset Voltage, Low Input Bias Current Op Amp with e-trim™
IC28-IC31 = ds_ic_opa:OPA197
J1 = ds_con:N10236-52B3PC: D-Sub Micro-D Connectors 36 CON M2.5 PANEL/GROUND
JP-3V3-1 JP-3V3-2 R1-R48 R50-R52 R57-R64 R67-R77 R87-R118 = ds_passive:R
L3 L4 = ds_passive:L
R49 R53-R56 = ds_passive:R-TRIM
R86 = Resistor Array:YC164-JR-0733RL: RES ARRAY 4 RES 33 OHM 1206 Manufacturer's datasheet <https://www.yageo.com/upload/media/product/productsearch/datasheet/rchip/PYu-YC_TC_group_51_RoHS_L_9.pdf>; CREATED_BY: PCBLayout.com; DIGIKEY_PN: YC164J-33TR-ND; MANUFACTURER: Yageo; MPN: YC164-JR-0733RL; PACKAGE: 1206
REF1 = ds_ic_vreg:LM4040BXX: Fixed voltage, 45-µA, precision micropower shunt voltage reference
RESET USB_BOOT = 52101-101-REV-A_v16:SWITCH-OMRON_B3U-1000P: SMD Tactile Switch - Ultra Small
T2 = transistor-power:IRLML5203: HEXFET P-Channel Power MOSFET
USBC = Wurth_Connectors_WR-USB:629722000214: WR-COM USB 2.0 Type C Receptacle Horizontal SMT Kind Properties Durability 10 000 Mating cycles Gender Receptacle Type Horizontal General Information Operating Temperature -40 up to +85 °C Electrical Properties Working Voltage 20 V (DC) Withstanding Voltage 100 V (AC) Contact Resistance 40 mΩ Material Properties Insulator Material LCP Insulator Flammability Rating UL94 V-0 Insulator Color Black Contact Material Brass Contact Plating Gold over Nickel Contact Type Stamped Shielding Material Steel Shielding Plating Nickel (Ni) <https://www.we-online.com/components/media/o689297v209%20family-wr-com-629722000214.jpg> Details see: www.we-online.com/en/components/products/WR-COM_USB_20_TYPE_C_RECEPTACLE_HORIZONTAL_SMT <www.we-online.com/catalog/WR-COM_USB_20_TYPE_C_RECEPTACLE_HORIZONTAL_SMT/?utm_source=eagle_model&utm_medium=description_link&utm_campaign=eisos_eagle> Updated by Ella Wu 2023-05-30 2023 (C) Würth Elektronik; APPLICATION: USB 2.0; DATASHEET-URL: https://www.we-online.com/redexpert/spec/629722000214?ae; GERDER: Receptacle; INTERFACE-TYPE: Type C; IR: 5A; MOUNT: SMT; PACKAGING: Tape and Reel; PART-NUMBER: 629722000214; PINS: 16; TYPE: Horizontal; VALUE: 629722000214; WORKING-VOLTAGE: 20V(AC)
X1 = ds_con:CON-VG_MAB64: CONNECTOR male, 94 pins, type B, rows AB, grid 2.54 mm
X2 = ds_passive:CRYSTAL

## Net classes
1 50R_DIFFPAIR: width 0.4 mm, drill 0.15 mm, clearance 0.191 mm
2 90R_DIFFPAIR: width 0.155 mm, drill 0.15 mm, clearance 0.191 mm
3 100R_DIFFPAIR: width 0.121 mm, drill 0.15 mm, clearance 0.191 mm